# EAGLE design untitled (EAGLE 6.2)
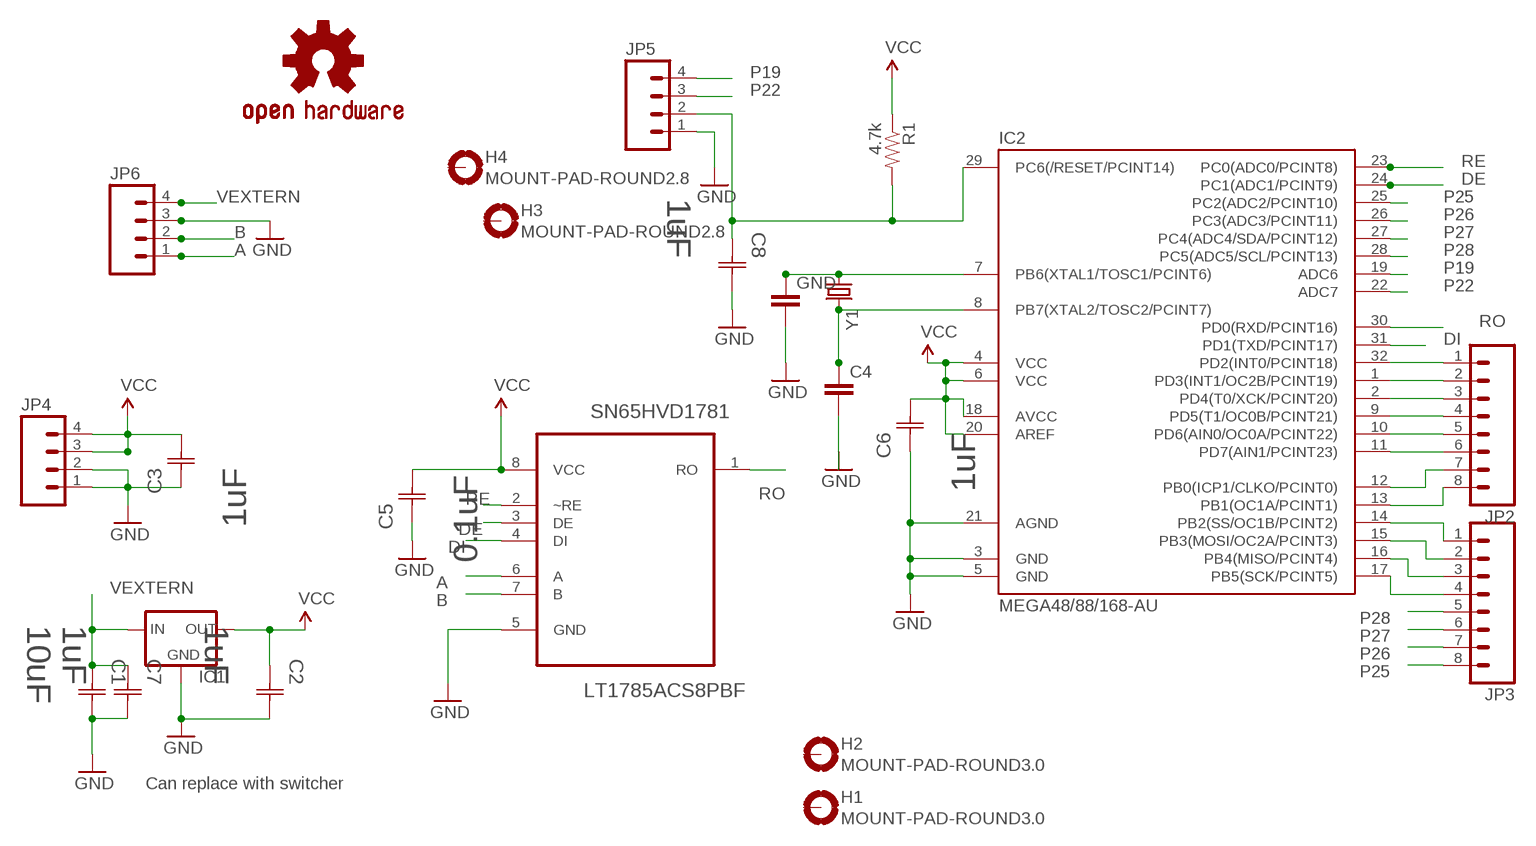
[diagram p0: schematic, sheet 1]

## Parts
C1  10uF  GRM32ER7YA106KA12L  [CAPC3225X270N]
C2  1uF  GRM21BR71H105KA12L  [CAPC2013X135N]
C3  1uF  GRM21BR71H105KA12L  [CAPC2013X135N]
C4  CAP0805  [0805]
C5  0.1uF  GRM21BR71H105KA12L  [CAPC2013X135N]
C6  1uF  GRM21BR71H105KA12L  [CAPC2013X135N]
C7  1uF  GRM21BR71H105KA12L  [CAPC2013X135N]
C8  1uF  GRM21BR71H105KA12L  [CAPC2013X135N]
GND  CAP0805  [0805]
H1  MOUNT-PAD-ROUND3.0  [3,0-PAD]
H2  MOUNT-PAD-ROUND3.0  [3,0-PAD]
H3  MOUNT-PAD-ROUND2.8  [2,8-PAD]
H4  MOUNT-PAD-ROUND2.8  [2,8-PAD]
IC1  V_REG_78XXSIDE  [78XXL]
IC2  MEGA48/88/168-AU  [TQFP32-08]
JP2  M08LOCK  [1X08_LOCK]
JP3  M08LOCK  [1X08_LOCK]
JP4  M04PTH  [1X04]
JP5  M04LOCK  [1X04_LOCK]
JP6  M04SCREW  [SCREWTERMINAL-3.5MM-4]
R1  4.7k  RESISTOR0805-RES  [0805]
SN65HVD1781  LT1785ACS8PBF  [SOIC127P600X175-8N]
U$1  OSHW-LOGOM  [OSHW-LOGO-M]
Y1  CRYSTALSMD  [HC49UP]

## Nets
A: JP6.1 SN65HVD1781.6(A)
B: JP6.2 SN65HVD1781.7(B)
DE: IC2.24(PC1(ADC1/PCINT9)) SN65HVD1781.3(DE)
DI: IC2.31(PD1(TXD/PCINT17)) SN65HVD1781.4(DI)
GND: C1.2(C2) C2.2(C2) C3.1(C1) C4.2 C5.1(C1) C6.1(C1) C7.2(C2) C8.2(C2) GND.2 IC1.GND IC2.3(GND) IC2.5(GND) IC2.21(AGND) JP4.1 JP4.2 JP5.1 JP6.3 SN65HVD1781.5(GND)
N$4: IC2.32(PD2(INT0/PCINT18)) JP2.1
N$5: IC2.1(PD3(INT1/OC2B/PCINT19)) JP2.2
N$6: IC2.2(PD4(T0/XCK/PCINT20)) JP2.3
N$7: IC2.9(PD5(T1/OC0B/PCINT21)) JP2.4
N$8: IC2.10(PD6(AIN0/OC0A/PCINT22)) JP2.5
N$9: IC2.11(PD7(AIN1/PCINT23)) JP2.6
N$10: IC2.12(PB0(ICP1/CLKO/PCINT0)) JP2.7
N$11: IC2.13(PB1(OC1A/PCINT1)) JP2.8
N$12: IC2.14(PB2(SS/OC1B/PCINT2)) JP3.1
N$13: IC2.15(PB3(MOSI/OC2A/PCINT3)) JP3.2
N$14: IC2.16(PB4(MISO/PCINT4)) JP3.3
N$15: IC2.17(PB5(SCK/PCINT5)) JP3.4
N$20: GND.1 IC2.7(PB6(XTAL1/TOSC1/PCINT6)) Y1.1
N$21: C4.1 IC2.8(PB7(XTAL2/TOSC2/PCINT7)) Y1.2
N$22: C8.1(C1) IC2.29(PC6(/RESET/PCINT14)) JP5.2 R1.2
P19: IC2.19(ADC6) JP5.4
P22: IC2.22(ADC7) JP5.3
P25: IC2.25(PC2(ADC2/PCINT10)) JP3.8
P26: IC2.26(PC3(ADC3/PCINT11)) JP3.7
P27: IC2.27(PC4(ADC4/SDA/PCINT12)) JP3.6
P28: IC2.28(PC5(ADC5/SCL/PCINT13)) JP3.5
RE: IC2.23(PC0(ADC0/PCINT8)) SN65HVD1781.2(~RE)
RO: IC2.30(PD0(RXD/PCINT16)) SN65HVD1781.1(RO)
VCC: C2.1(C1) C3.2(C2) C5.2(C2) C6.2(C2) IC1.OUT IC2.4(VCC) IC2.6(VCC) IC2.18(AVCC) IC2.20(AREF) JP4.3 JP4.4 R1.1 SN65HVD1781.8(VCC)
VEXTERN [vextern]: C1.1(C1) C7.1(C1) IC1.IN JP6.4
Unconnected: H1.B3,0(MOUNT) H2.B3,0(MOUNT) H3.B2,8(MOUNT) H4.B2,8(MOUNT)

## Notes on the sheet
- Can replace with switcher

## Library data of the parts
C1 = Murata_By_element14_Batch_1:GRM32ER7YA106KA12L: CAPACITOR, 1210; MPN: GRM32ER7YA106KA12L; OC_FARNELL: 1735537; OC_NEWARK: 24R2634; SUPPLIER: Murata; TOLERANCE: ±10%; VOLTAGERATING: 35V
C2 C3 C6-C8 = Murata_By_element14_Batch_1:GRM21BR71H105KA12L: CAPACITOR, 0805; MPN: GRM21BR71H105KA12L; OC_FARNELL: 1735541; OC_NEWARK: 24R6342; SUPPLIER: Murata; TOLERANCE: ±10%; VOLTAGERATING: 50V
C4 GND = SparkFun - Copy:CAP: Capacitor Standard 0603 ceramic capacitor, and 0.1" leaded capacitor.
C5 = Murata_By_element14_Batch_1:GRM21BR71H105KA12L: CAPACITOR, 0805; MPN: GRM21BR71H105KA12L; OC_FARNELL: 1735541; OC_NEWARK: 24R6342; SUPPLIER: Murata; TOLERANCE: ±10%; VALUE: 1uF; VOLTAGERATING: 50V
H1-H4 = holes:MOUNT-PAD-ROUND: MOUNTING PAD, round
IC1 = SparkFun - Copy:V_REG_78XX: Voltage Regulator Standard 7805 5V regulator. IGO (Input Ground Output). Spark Fun Electronics SKU : COM-00107
IC2 = avr-6:MEGA48/88/168
JP2 JP3 = SparkFun - Copy:M08: Header 8 Standard 8-pin 0.1" header. Use with straight break away headers (SKU : PRT-00116), right angle break away headers (PRT-00553), swiss pins (PRT-00743), machine pins (PRT-00117), and female headers (PRT-00115).
JP4-JP6 = SparkFun - Copy:M04: Header 4 Standard 4-pin 0.1" header. Use with straight break away headers (SKU : PRT-00116), right angle break away headers (PRT-00553), swiss pins (PRT-00743), machine pins (PRT-00117), and female headers (PRT-00115). Molex polarized connector foot print use with SKU : PRT-08231 with associated crimp pins and housings. 1MM SMD Version SKU: PRT-10208
R1 = SparkFun - Copy:RESISTOR: Resistor Basic schematic elements and footprints for 0603, 1206, and PTH resistors.
SN65HVD1781 = LTC_By_element14_Batch_1:LT1785ACS8PBF: 60V Fault Protected RS485/RS422 Transceivers; MPN: LT1785ACS8#PBF; OC_FARNELL: 1663496; OC_NEWARK: 57M6405; PACKAGE: SOIC-8; SUPPLIER: Linear Technology
U$1 = SparkFun - Copy:OSHW-LOGO: Open Source Hardware Logo This logo indicates the piece of hardware it is found on incorporates a OSHW license and/or adheres to the definition of open source hardware found here: http://freedomdefined.org/OSHW
Y1 = SparkFun - Copy:CRYSTAL: Crystals Various standard crystals. Proven footprints. Spark Fun Electronics SKU : COM-00534

## Net classes
1 vextern: clearance 0.254 mm

## Board
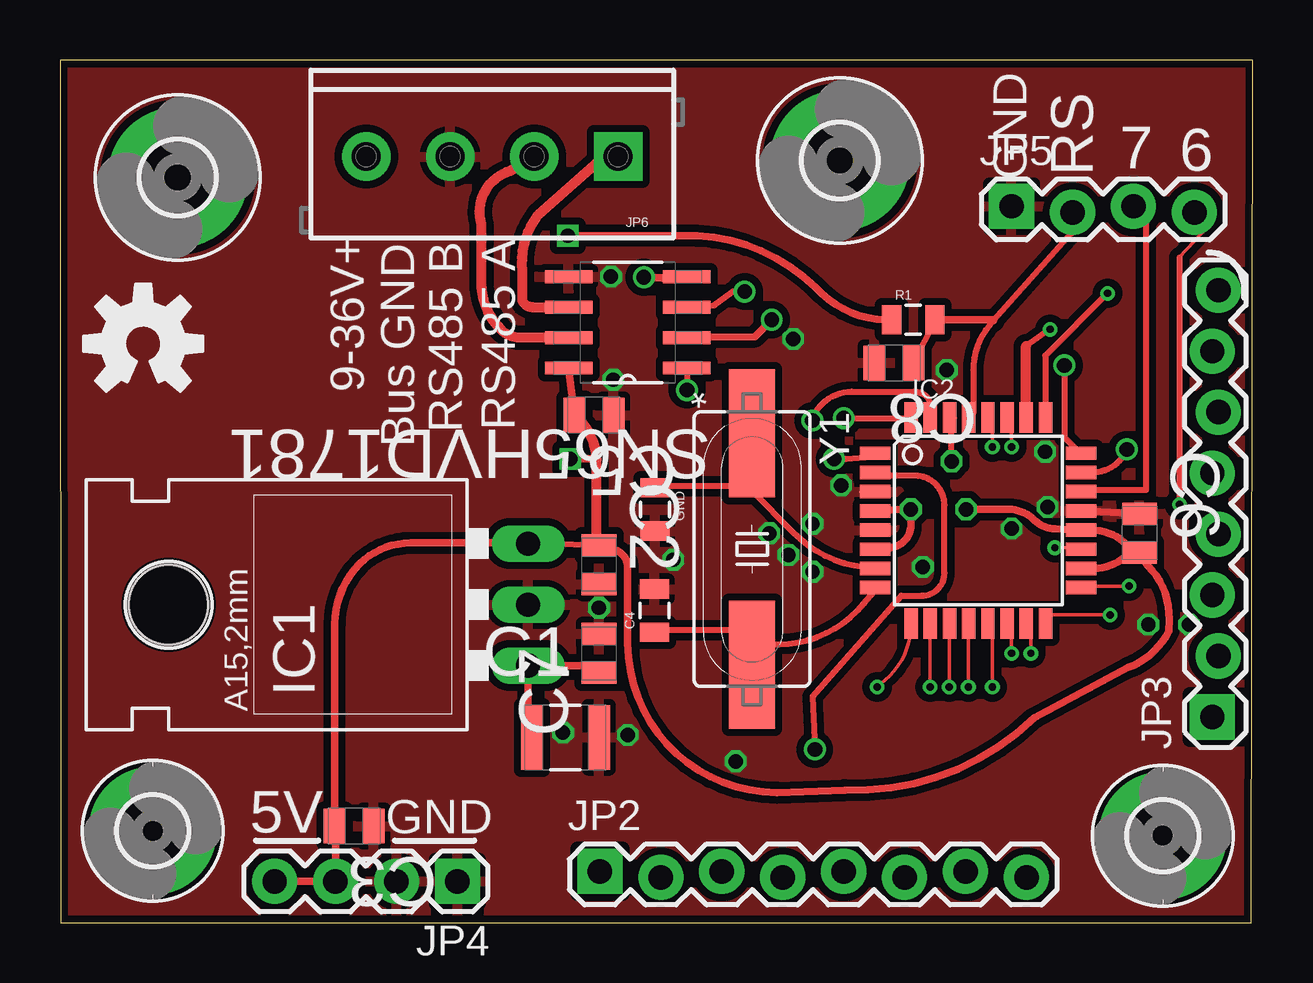
[diagram p1: board, top side]
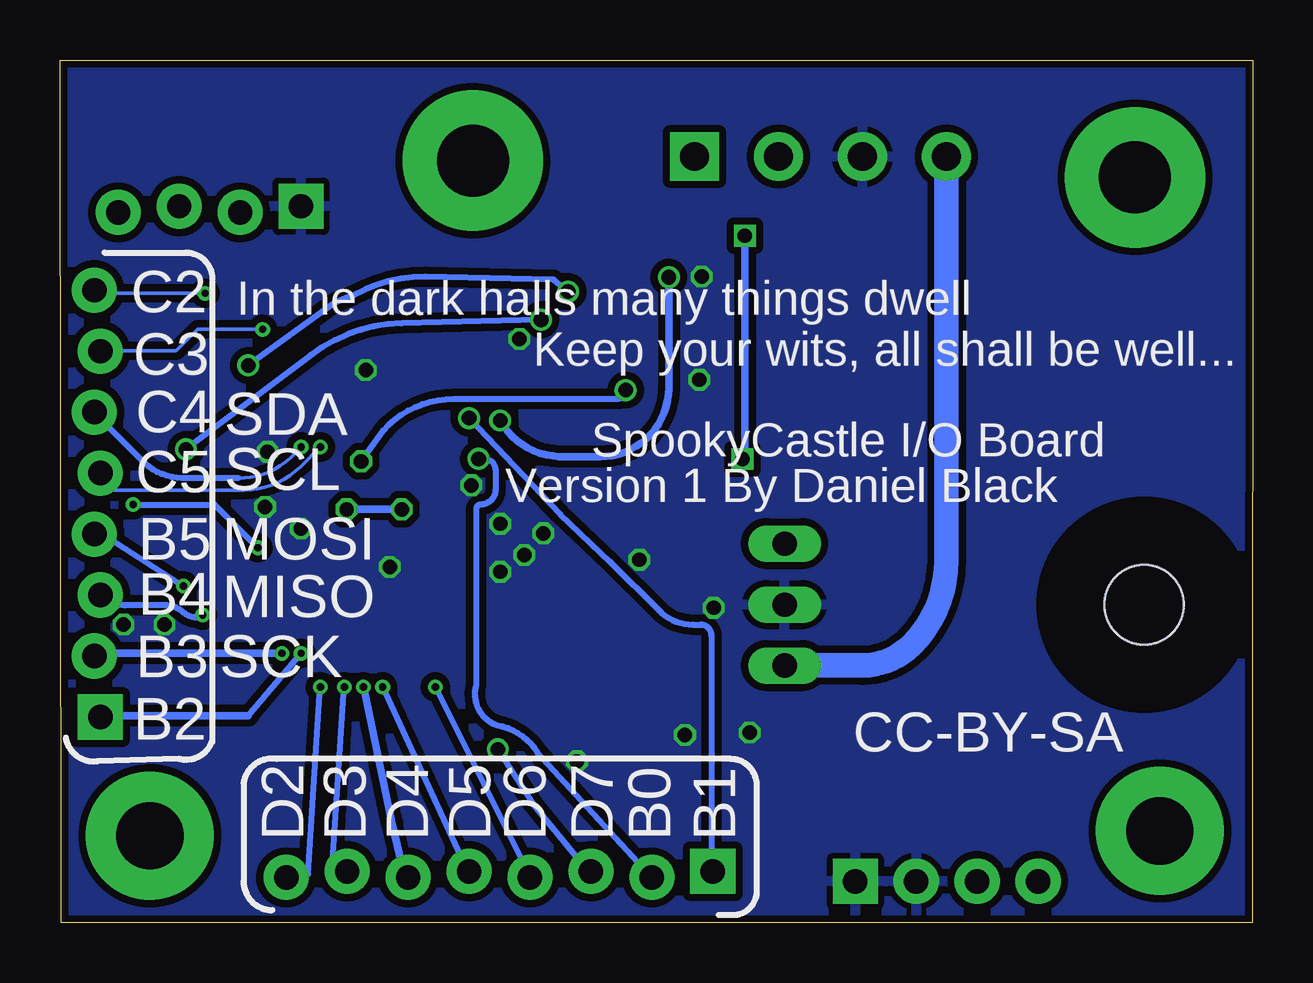
[diagram p2: board, bottom side, seen from below]

Size 49.72 x 35.95 mm. Coordinates in mm from the lower left corner, seen from the top.
Outline: 0.02,0 49.67,0 49.72,35.95 0,35.95 0.02,0
Copper layers (1*16): Top 0.035mm / dielectric 1.5mm / Bottom 0.035mm
Design rules: minimum track width 6mil, minimum drill 12mil, track to track 6mil, track to pad 6mil, pad to pad 6mil, via to via 6mil, smd to smd 0mil, copper to edge 10mil, drill to drill 10mil, minimum pad ring 10mil, minimum via ring 6mil, stop-mask expansion 2mil, vias tented up to drill 100mil, thermal gap 10mil

### Footprints (pad centres in the part's own frame; a part is rotated, then mirrored left to right if it is on the bottom)
CAPC3225X270N = smd 0.914 x 2.692: 1 -1.397,0; 2 1.397,0
CAPC2013X135N = smd 0.914 x 1.448: 1 -0.813,0; 2 0.813,0
0805 = smd 0.8 x 1.2: 1 -0.9,0; 2 0.9,0
3,0-PAD = drill 3 pad 5.842: B3,0 0,0
2,8-PAD = drill 2.8 pad 5.334: B2,8 0,0
78XXL = drill 1.016 long: GND 0,-3.81; IN -2.54,-3.81; OUT 2.54,-3.81 | hole 3.302: 0,11.176
TQFP32-08 = smd 1.27 x 0.559: 1 -4.293,2.8; 2 -4.293,2; 3 -4.293,1.2; 4 -4.293,0.4; 5 -4.293,-0.4; 6 -4.293,-1.2; 7 -4.293,-2; 8 -4.293,-2.8; 17 4.293,-2.8; 18 4.293,-2; 19 4.293,-1.2; 20 4.293,-0.4; 21 4.293,0.4; 22 4.293,1.2; 23 4.293,2; 24 4.293,2.8 | smd 0.559 x 1.27: 9 -2.8,-4.293; 10 -2,-4.293; 11 -1.2,-4.293; 12 -0.4,-4.293; 13 0.4,-4.293; 14 1.2,-4.293; 15 2,-4.293; 16 2.8,-4.293; 25 2.8,4.293; 26 2,4.293; 27 1.2,4.293; 28 0.4,4.293; 29 -0.4,4.293; 30 -1.2,4.293; 31 -2,4.293; 32 -2.8,4.293
1X08_LOCK = drill 1.016 pad 1.88 square: 1 0,0.127 | drill 1.016 pad 1.88: 2 2.54,-0.127; 3 5.08,0.127; 4 7.62,-0.127; 5 10.16,0.127; 6 12.7,-0.127; 7 15.24,0.127; 8 17.78,-0.127
1X04 = drill 1.016 pad 1.88 square: 1 0,0 | drill 1.016 pad 1.88: 2 2.54,0; 3 5.08,0; 4 7.62,0
1X04_LOCK = drill 1.016 pad 1.88 square: 1 0,0.127 | drill 1.016 pad 1.88: 2 2.54,-0.127; 3 5.08,0.127; 4 7.62,-0.127
SCREWTERMINAL-3.5MM-4 = drill 1.2 pad 2.032 square: 1 0,0 | drill 1.2 pad 2.032: 2 3.5,0; 3 7,0; 4 10.5,0
SOIC127P600X175-8N = smd 1.981 x 0.533: 1 -2.464,1.905; 2 -2.464,0.635; 3 -2.464,-0.635; 4 -2.464,-1.905; 5 2.464,-1.905; 6 2.464,-0.635; 7 2.464,0.635; 8 2.464,1.905
HC49UP = smd 5.334 x 1.93: 1 -4.826,0; 2 4.826,0

### Placement (x,y rotation side)
C1  21.07,7.73 0 top
C2  22.47,14.93 270 top
C3  12.27,4.03 180 top
C4  24.78,13.01 90 top
C5  22.26,21.16 180 top
C6  45,16.24 270 top
C7  22.47,11.23 90 top
C8  34.77,23.33 180 top
GND  24.81,17.22 270 top
H1  4.91,31.06 0 top
H2  32.51,31.76 0 top
H3  3.87,3.83 0 top
H4  45.97,3.63 0 top
IC1  15.7,13.26 90 top
IC2  38.28,16.77 0 top
JP2  22.51,2.02 0 top
JP3  48.16,8.58 90 top
JP4  16.57,1.73 180 top
JP5  39.67,29.73 0 top
JP6  23.27,31.93 180 top
R1  35.57,25.13 0 top
SN65HVD1781  23.67,25.02 180 top
U$1  3.47,24.13 0 top
Y1  28.85,15.57 270 top

### Tracks (layer width: path | path; a pad name or v marks a point on that pad's centre or on a via)
A
  Top 0.406: JP6.1 22.67,31.93 19.93,29.5 arc45 19.27,27.16 19.27,25.93 arc66 19.69,25.66 SN65HVD1781.6
B
  Top 0.406: SN65HVD1781.7 19.15,24.39 arc-45 18.4,24.7 arc-45 17.57,26.71 17.57,29.13 arc-90 18.77,31.33 JP6.2
DE  (via drill 0.61)
  Top 0.254: v28.54,26.3 28.04,26.3 27.27,25.73 26.14,25.7 SN65HVD1781.3 | v41.87,23.23 41.87,20.23 42.47,19.63 IC2.24
  Bottom 0.254: v28.54,26.3 29.14,26.8 34.48,26.92 arc-30 37.49,26.14 38.27,25.83 v41.87,23.23
DI  (via drill 0.61)
  Top 0.254: 25.94,26.9 v24.34,26.9 | v31.37,20.93 31.39,21.09 arc-66 33.01,22.13 35.61,22.13 arc-37 36.07,21.97 arc-53 36.27,21.59 36.27,21.23 IC2.31
  Top 0.305: SN65HVD1781.4 26.47,26.93 26.57,26.83 25.47,26.83 v24.34,26.9
  Bottom 0.305: v24.34,26.9 24.34,22.3 arc90 27.21,19.42 28.92,19.42 28.92,19.43 arc59 v31.37,20.93
GND  (via drill 0.6 pad 0.3)
  Top 0.305: IC2.21 C6.1 | IC2.3 33.46,17.95
  other vias: 31.37,16.63 29.57,16.23 30.37,15.33 31.37,14.63 41.17,17.33 30.57,24.33 23.07,22.63 22.97,26.93 45.37,12.43 35.97,14.83 39.67,16.43 47.07,12.43 36.97,23.03 22.47,13.13 20.97,7.93 25.57,15.13 41.07,19.63 32.57,18.23 23.67,7.83 28.17,6.73
  pour Bottom (isolate 0.305): 0.24,35.63 -0.03,0.25 49.59,0.35 49.35,35.94
  pour Top (isolate 0.305): 0.14,35.53 -0.05,0 49.59,0.35 49.3,35.98
N$4  (via drill 0.61)
  Top 0.254: v32.67,21.03 35.47,21.03 IC2.32
  Bottom 0.152: 22.57,1.83 JP2.1 22.57,2.23
  Bottom 0.254: v32.67,21.03 28.87,17.03 26.77,15.03 24.75,13.02 arc-45 23.34,12.43 23.01,12.43 arc90 22.57,11.98 22.57,2.23
N$5  (via drill 0.61)
  Top 0.254: v32.27,19.33 32.77,19.33 33.87,19.43 IC2.1
  Bottom 0.152: 25.17,1.63 JP2.2 25.17,2.03
  Bottom 0.254: v32.27,19.33 32.01,19.33 arc90 31.57,18.88 31.57,18.04 arc90 32.17,17.43 arc-90 32.37,17.24 32.37,9.93 arc-90 31.47,8.23 arc48 29.82,7.12 25.17,2.03
N$6  (via drill 0.61)
  Top 0.254: IC2.2 34.07,18.63 35.65,18.63 arc-90 36.87,17.41 36.87,14.57 arc-90 35.92,13.63 35.07,13.63 31.37,9.43 v31.47,7.23
  Bottom 0.152: 27.77,1.83 JP2.3 27.77,2.23
  Bottom 0.254: 27.77,2.23 29.97,4.93 v31.47,7.23
N$7  (via drill 0.3)
  Top 0.152: v34.07,9.83 34.4,10.12 arc49 35.47,12.43 IC2.9
  Bottom 0.152: 30.17,2.03 JP2.4
  Bottom 0.254: 30.17,2.03 v34.07,9.83
N$8  (via drill 0.3)
  Top 0.152: v36.27,9.83 36.27,12.43 IC2.10
  Bottom 0.152: 32.77,2.23 JP2.5
  Bottom 0.254: 32.77,2.23 v36.27,9.83
N$9  (via drill 0.3)
  Top 0.152: v37.07,9.83 37.07,12.43 IC2.11
  Bottom 0.152: 35.37,2.03 JP2.6
  Bottom 0.305: 35.37,2.03 35.87,4.13 v37.07,9.83
N$10  (via drill 0.3)
  Top 0.152: v37.87,9.83 37.87,12.43 IC2.12
  Bottom 0.152: 38.37,2.23 37.77,2.23 JP2.7
  Bottom 0.254: 38.37,2.23 v37.87,9.83
N$11  (via drill 0.3)
  Top 0.152: v38.87,9.83 38.87,12.43 IC2.13
  Bottom 0.152: 39.37,2.03 40.17,2.03 JP2.8
  Bottom 0.254: 39.37,2.03 v38.87,9.83
N$12  (via drill 0.3)
  Top 0.152: v39.67,11.23 39.67,12.43 IC2.14
  Bottom 0.152: 48.87,8.63 JP3.1
  Bottom 0.254: 41.87,8.63 v39.67,11.23
  Bottom 0.305: 41.87,8.63 47.98,8.63 JP3.1
N$13  (via drill 0.3)
  Top 0.152: v40.47,11.23 40.47,12.43 IC2.15
  Bottom 0.305: v40.47,11.23 48.17,11.23 JP3.2
N$14  (via drill 0.3)
  Top 0.152: v43.77,12.83 41.07,12.83 IC2.16
  Bottom 0.254: v43.77,12.83 43.88,12.73 arc45 44.54,12.9 arc-45 45.33,13.23 47,13.23 arc45 JP3.3
N$15  (via drill 0.3)
  Top 0.152: v44.57,14.03 42.67,14.03 IC2.17
  Bottom 0.152: 47.67,16.03 48.27,16.03 JP3.4
  Bottom 0.254: 47.67,16.03 v44.57,14.03
N$20
  Top 0.254: 28.84,18.2 24.64,18.2 GND.1 | 28.84,18.2 28.84,20.2 Y1.1 | 28.84,18.2 28.84,18 | 28.84,18.2 Y1.1 | 28.84,18 30.55,16.29 arc45 33.94,14.8 IC2.7 | 28.84,18 Y1.1
N$21
  Top 0.254: 28.84,12.2 24.64,12.2 C4.1 | 28.84,11.6 28.84,10.8 Y1.2 | 28.84,11.6 28.84,12.2 | 28.84,12.2 Y1.2 | 28.84,11.6 29.98,11.6 arc49 33.51,13.31 33.94,13.8 IC2.8 | 28.84,11.6 Y1.2
N$22
  Top 0.152: 38.07,21.23 IC2.29 | 42.17,28.73 JP5.2
  Top 0.254: 38.07,21.23 38.07,23.03 arc-45 38.92,25.08 42.17,28.73 | 36.48,25.13 C8.1
  Top 0.305: R1.2 36.48,25.13 38.87,25.13 38.92,25.08
P19  (via drill 0.3)
  Top 0.152: v41.47,15.63 42.47,15.63 IC2.19 | 46.67,27.73 47.87,29.03 JP5.4
  Top 0.254: 46.67,27.73 v46.67,17.43
  Bottom 0.254: v41.47,15.63 43.27,17.43 v46.67,17.43
P22
  Top 0.152: 42.67,18.03 IC2.22 | 45.27,29.23 JP5.3
  Top 0.254: 45.27,29.23 45.27,18.03 42.67,18.03
P25  (via drill 0.3)
  Top 0.152: 41.07,21.23 IC2.25
  Top 0.254: 41.07,21.23 41.07,23.63 v43.67,26.23
  Bottom 0.152: v43.67,26.23 48.27,26.23 JP3.8
P26  (via drill 0.3)
  Top 0.254: v41.27,24.73 40.27,24.03
  Top 0.406: IC2.26 40.27,21.16 40.27,24.03
  Bottom 0.152: 48.87,23.83 48.07,23.83 | 48.07,23.83 44.87,23.83 43.97,24.73 v41.27,24.73 | 48.07,23.83 JP3.7
P27  (via drill 0.3)
  Top 0.152: v39.67,19.83 39.67,20.83 39.47,21.03 IC2.27
  Bottom 0.152: 42.29,18.53 arc-45 40.13,19.37 v39.67,19.83 | 48.27,21.23 JP3.6
  Bottom 0.254: 42.29,18.53 44.44,18.53 arc45 46.19,19.16 48.27,21.23
P28  (via drill 0.3)
  Top 0.152: v38.87,19.83 38.87,21.03 IC2.28
  Bottom 0.152: 47.97,18.03 42.04,18.03 arc-45 39.69,19 v38.87,19.83 | 48.07,18.63 JP3.5
  Bottom 0.254: 47.97,18.03 48.03,18.03 JP3.5
RE  (via drill 0.61)
  Top 0.254: 26.64,24.4 26.14,24.3 SN65HVD1781.2 | v44.47,19.73 arc-70 42.99,18.76 IC2.23
  Top 0.305: 26.64,24.4 28.97,24.43 v29.67,25.13
  Bottom 0.254: v29.67,25.13 35.48,24.98 arc-36 39.24,23.67 v44.47,19.73
RO  (via drill 0.61)
  Top 0.254: v26.14,22.2 26.14,23 SN65HVD1781.1 | v37.17,19.23 37.17,20.73 37.07,20.83 37.27,21.03 IC2.30
  Bottom 0.254: v37.17,19.23 36.25,20.51 arc48 33.3,21.83 26.51,21.83 arc-90 v26.14,22.2
VCC  (via drill 0.6, 0.6 pad 0.3)
  Top 0.152: IC2.6 34.07,15.63 34.17,15.57
  Top 0.254: 21.14,23.1 SN65HVD1781.8 21.64,23.2 | 34.47,15.63 34.17,15.57 | 34.04,17.2 IC2.4 | 22.37,15.73 IC1.OUT
  Top 0.305: 34.04,17.2 v35.47,17.23 35.47,16.57 arc-90 34.52,15.63 34.47,15.63 | v37.77,17.23 39.54,17.23 arc-45 40.61,16.78 arc43 41.47,16.41 IC2.20 42.97,16.37 arc-45 44.49,15.74 C6.2 | C5.2 SN65HVD1781.8 | C6.2 45.34,14.88 arc-47 46.23,12.65 46.22,12.15 arc-42 44.54,10.64 40.62,8.54 arc-46 32.71,5.53 29.88,5.43 arc-90 23.67,11.64 23.67,14.79 arc68 23.17,15.53 22.48,15.43 C2.1 22.37,15.83 | IC1.OUT 19.48,15.83 14.61,15.83 arc45 12.49,14.95 arc45 11.45,12.45 C3.2 11.49,4 JP4.3 JP4.4 | IC2.18 43.08,14.77 arc45 44.54,15.37 C6.2 | R1.1 34.42,25.13 arc-47 31.49,26.47 arc47 25.88,28.63 v21.17,28.63 | v21.27,19.33 22.34,19.33 22.37,19.31
  Top 0.406: 22.37,15.73 22.37,15.83 22.37,19.31 arc48 C5.2
  Bottom 0.305: v35.47,17.23 v37.77,17.23 | v21.17,28.63 21.17,19.43 v21.27,19.33
VEXTERN
  Top 0.305: C1.1 19.51,8.29 IC1.IN 22.17,10.72 C7.1
  Bottom 1.016: JP6.4 12.77,15.1 arc45 14.23,11.57 arc45 16.25,10.73 19.48,10.73 arc-45 IC1.IN

### Text on the board
tPlace: GND | 5V | GND
_tsilk: 7 | 6 | RS | 9-36V+ | RS485 B | RS485 A | Bus GND
_bsilk: In the dark halls many things dwell | C2 | Keep your wits, all shall be well... | C3 | C4 | SpookyCastle I/O Board | SDA | Version 1 By Daniel Black | SCL | C5 | MOSI | B5 | MISO | B4 | SCK | B3 | B2 | CC-BY-SA | B1 | B0 | D7 | D6 | D5 | D4 | D3 | D2